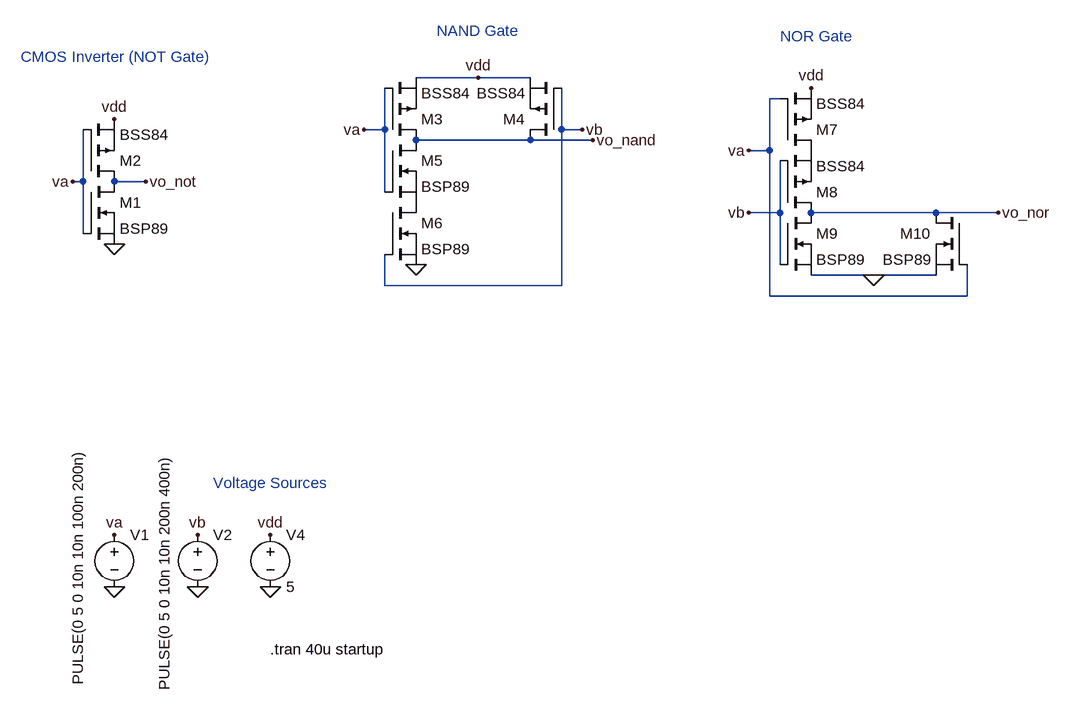
[diagram p0: schematic CMOS Gates.asc]
CMOS Gates.asc, the LTspice schematic file:
Version 4.1
SHEET 1 2084 968
WIRE 672 0 576 0
WIRE 752 0 672 0
WIRE 1136 32 1120 32
WIRE 528 80 528 16
WIRE 528 80 496 80
WIRE 800 80 800 16
WIRE 832 80 800 80
WIRE 752 96 576 96
WIRE 848 96 752 96
WIRE 1120 112 1120 32
WIRE 1120 112 1088 112
WIRE 64 160 64 80
WIRE 64 160 48 160
WIRE 160 160 112 160
WIRE 528 176 528 80
WIRE 1136 208 1136 128
WIRE 1136 208 1088 208
WIRE 1376 208 1184 208
WIRE 1472 208 1376 208
WIRE 64 240 64 160
WIRE 1136 288 1136 208
WIRE 1280 304 1184 304
WIRE 1376 304 1280 304
WIRE 528 320 528 272
WIRE 800 320 800 80
WIRE 800 320 528 320
WIRE 1120 336 1120 112
WIRE 1424 336 1424 288
WIRE 1424 336 1120 336
FLAG 160 160 vo_not
FLAG 48 160 va
FLAG 112 64 vdd
FLAG 112 784 0
FLAG 240 784 0
FLAG 112 704 va
FLAG 240 704 vb
FLAG 352 784 0
FLAG 352 704 vdd
FLAG 112 256 0
FLAG 848 96 vo_nand
FLAG 672 0 vdd
FLAG 496 80 va
FLAG 832 80 vb
FLAG 576 288 0
FLAG 1184 16 vdd
FLAG 1280 304 0
FLAG 1472 208 vo_nor
FLAG 1088 112 va
FLAG 1088 208 vb
SYMBOL nmos 64 160 R0
SYMATTR InstName M1
SYMATTR Value BSP89
SYMBOL pmos 64 160 M180
SYMATTR InstName M2
SYMATTR Value BSS84
SYMBOL voltage 112 688 R0
WINDOW 3 -56 -117 VRight 2
WINDOW 123 0 0 Left 0
WINDOW 39 0 0 Left 0
SYMATTR Value PULSE(0 5 0 10n 10n 100n 200n)
SYMATTR InstName V1
SYMBOL voltage 240 688 R0
WINDOW 3 -51 -109 VRight 2
WINDOW 123 0 0 Left 0
WINDOW 39 0 0 Left 0
SYMATTR Value PULSE(0 5 0 10n 10n 200n 400n)
SYMATTR InstName V2
SYMBOL voltage 352 688 R0
WINDOW 123 0 0 Left 0
WINDOW 39 0 0 Left 0
SYMATTR InstName V4
SYMATTR Value 5
SYMBOL pmos 528 96 M180
SYMATTR InstName M3
SYMATTR Value BSS84
SYMBOL pmos 800 96 R180
SYMATTR InstName M4
SYMATTR Value BSS84
SYMBOL nmos 528 96 R0
SYMATTR InstName M5
SYMATTR Value BSP89
SYMBOL nmos 528 192 R0
SYMATTR InstName M6
SYMATTR Value BSP89
SYMBOL pmos 1136 112 M180
SYMATTR InstName M7
SYMATTR Value BSS84
SYMBOL pmos 1136 208 M180
SYMATTR InstName M8
SYMATTR Value BSS84
SYMBOL nmos 1136 208 R0
SYMATTR InstName M9
SYMATTR Value BSP89
SYMBOL nmos 1424 208 M0
SYMATTR InstName M10
SYMATTR Value BSP89
TEXT 352 880 Left 2 !.tran 40u startup
TEXT -32 -32 Left 2 ;CMOS Inverter (NOT Gate)
TEXT 264 624 Left 2 ;Voltage Sources
TEXT 608 -72 Left 2 ;NAND Gate
TEXT 1136 -64 Left 2 ;NOR Gate

The netlist it stands for:
* CMOS Gates.asc
M1 vo_not va 0 0 BSP89
M2 vo_not va vdd vdd BSS84
V1 va 0 PULSE(0 5 0 10n 10n 100n 200n)
V2 vb 0 PULSE(0 5 0 10n 10n 200n 400n)
V4 vdd 0 5
M3 vo_nand va vdd vdd BSS84
M4 vo_nand vb vdd vdd BSS84
M5 vo_nand va P001 P001 BSP89
M6 P001 vb 0 0 BSP89
M7 P002 va vdd vdd BSS84
M8 vo_nor vb P002 P002 BSS84
M9 vo_nor vb 0 0 BSP89
M10 vo_nor va 0 0 BSP89
.model NMOS NMOS
.model PMOS PMOS
.lib standard.mos
.tran 40u startup
* CMOS Inverter (NOT Gate)
* Voltage Sources
* NAND Gate
* NOR Gate
.backanno
.end